# EAGLE design 04B-060 (EAGLE 9.6.2)
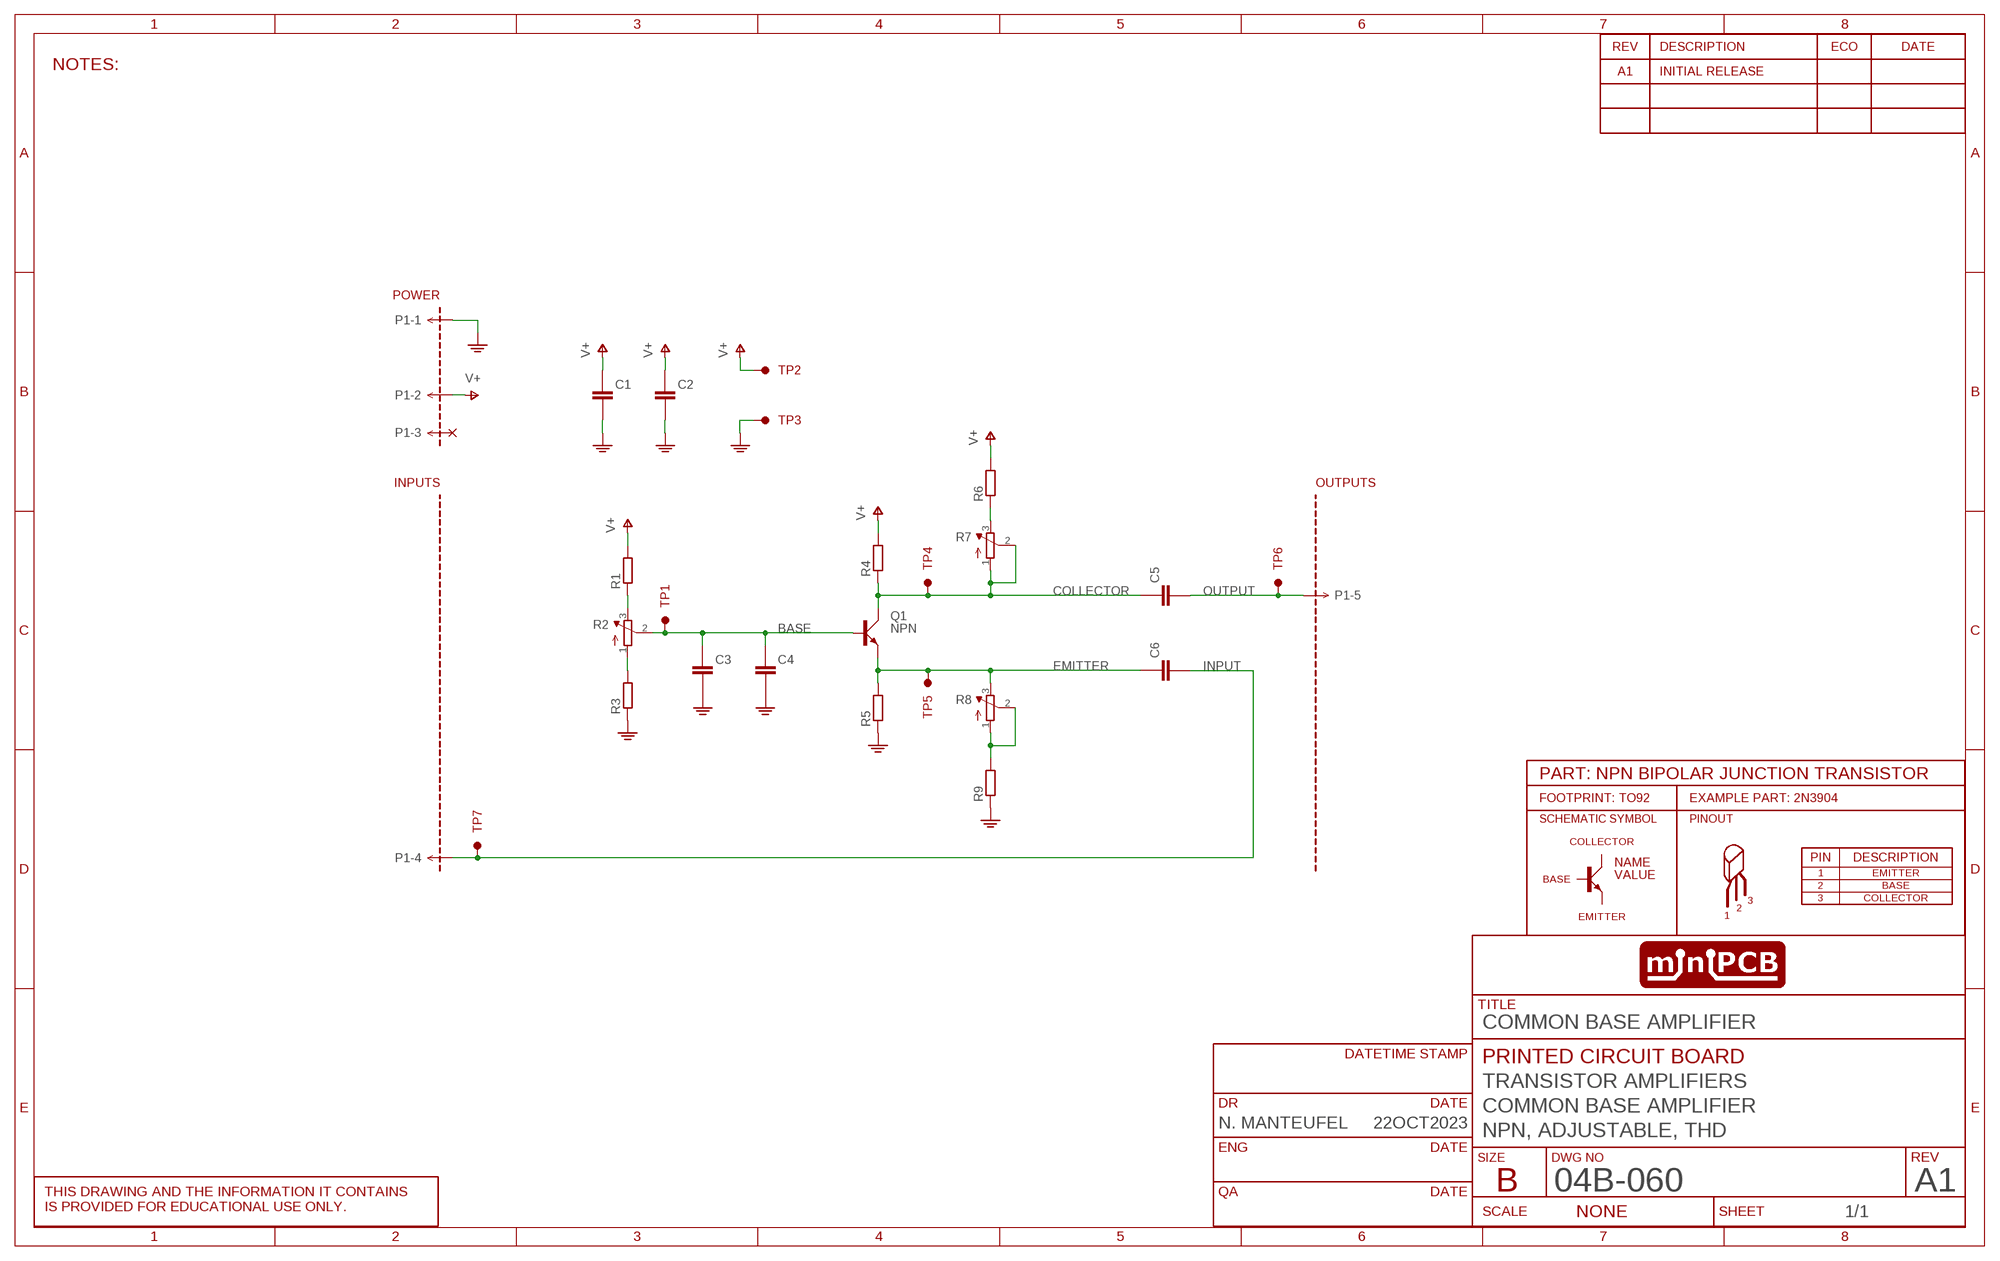
[diagram p0: schematic, sheet 1]
SHEET1 (SCHEMATIC): CIRCUIT_CATEGORY: TRANSISTOR AMPLIFIERS; CIRCUIT_NAME: COMMON BASE AMPLIFIER; CIRCUIT_VARIANT: NPN, ADJUSTABLE, THD; DR: N. MANTEUFEL; DR_DATE: 22OCT2023; PCB_PCBA: PRINTED CIRCUIT BOARD; REVA: A1; REVISION: A1; TITLE: COMMON BASE AMPLIFIER

## Parts
C1  CAPACITOR_10  [C5MM]
C2  CAPACITORTHD  [C050-024X044]
C3  CAPACITOR_10  [C5MM]
C4  CAPACITORTHD  [C050-024X044]
C5  CAPACITORTHD  [C050-024X044]
C6  CAPACITORTHD  [C050-024X044]
P1  MINIPCB_5P5P  [PINS_1X5]
PCB1  MINIPCB_0P50X50  [MINIPCB_0P_50X50MM]
Q1  NPN  BJT_NPNEBC  [TO92-EBC-OVAL]
R1  RESISTORTHD  [0204/10]
R2  TRIMPOT0.100THD  [TRIM_0100]
R3  RESISTORTHD  [0204/10]
R4  RESISTORTHD  [0204/10]
R5  RESISTORTHD  [0204/10]
R6  RESISTORTHD  [0204/10]
R7  TRIMPOT0.100THD  [TRIM_0100]
R8  TRIMPOT0.100THD  [TRIM_0100]
R9  RESISTORTHD  [0204/10]
TP1  TESTPOINTKE5000-SMTEXT  [PINS_1_TESTPOINT_KE5000_NOTEXT]
TP2  TESTPOINTKE5000-SMTEXT  [PINS_1_TESTPOINT_KE5000_NOTEXT]
TP3  TESTPOINTKE5000-SMTEXT  [PINS_1_TESTPOINT_KE5000_NOTEXT]
TP4  TESTPOINTKE5000-SMTEXT  [PINS_1_TESTPOINT_KE5000_NOTEXT]
TP5  TESTPOINTKE5000-SMTEXT  [PINS_1_TESTPOINT_KE5000_NOTEXT]
TP6  TESTPOINTKE5000-SMTEXT  [PINS_1_TESTPOINT_KE5000_NOTEXT]
TP7  TESTPOINTKE5000-SMTEXT  [PINS_1_TESTPOINT_KE5000_NOTEXT]

## Nets
BASE: C3.+ C4.1(+) Q1.B R2.2(S) TP1.1
COLLECTOR: C5.1(+) Q1.C R4.1 R7.1(A) R7.2(S) TP4.1
EMITTER: C6.1(+) Q1.E R5.2 R8.3(E) TP5.1
GND: C1.- C2.2(-) C3.- C4.2(-) P1.1 R3.1 R5.1 R9.1 TP3.1
INPUT: C6.2(-) P1.4 TP7.1
N$1: R2.1(A) R3.2
N$2: R1.1 R2.3(E)
N$3: R8.1(A) R8.2(S) R9.2
N$4: R6.1 R7.3(E)
OUTPUT: C5.2(-) P1.5 TP6.1
V+: C1.+ C2.1(+) P1.2 R1.2 R4.2 R6.2 TP2.1
Unconnected: P1.3

## Notes on the sheet
- NOTES:

## Library data of the parts
C1-C6 = minipcb:CAPACITOR
P1 = minipcb:MINIPCB_5P
PCB1 = minipcb:MINIPCB_0P; CIRCUIT_CATEGORY: TRANSISTOR AMPLIFIERS; PART_NUMBER: 04B-060; REVISION: A1-01; TITLE: COMMON BASE AMPLIFIER
Q1 = minipcb:BJT_NPN: TRANSISTOR
R1 R3-R6 R9 = minipcb:RESISTOR
R2 R7 R8 = minipcb:TRIMPOT: SMT trimmer potentiometer part number TC33X http://www.ladyada.net/library/eagle
TP1-TP7 = minipcb:TESTPOINT

## Board
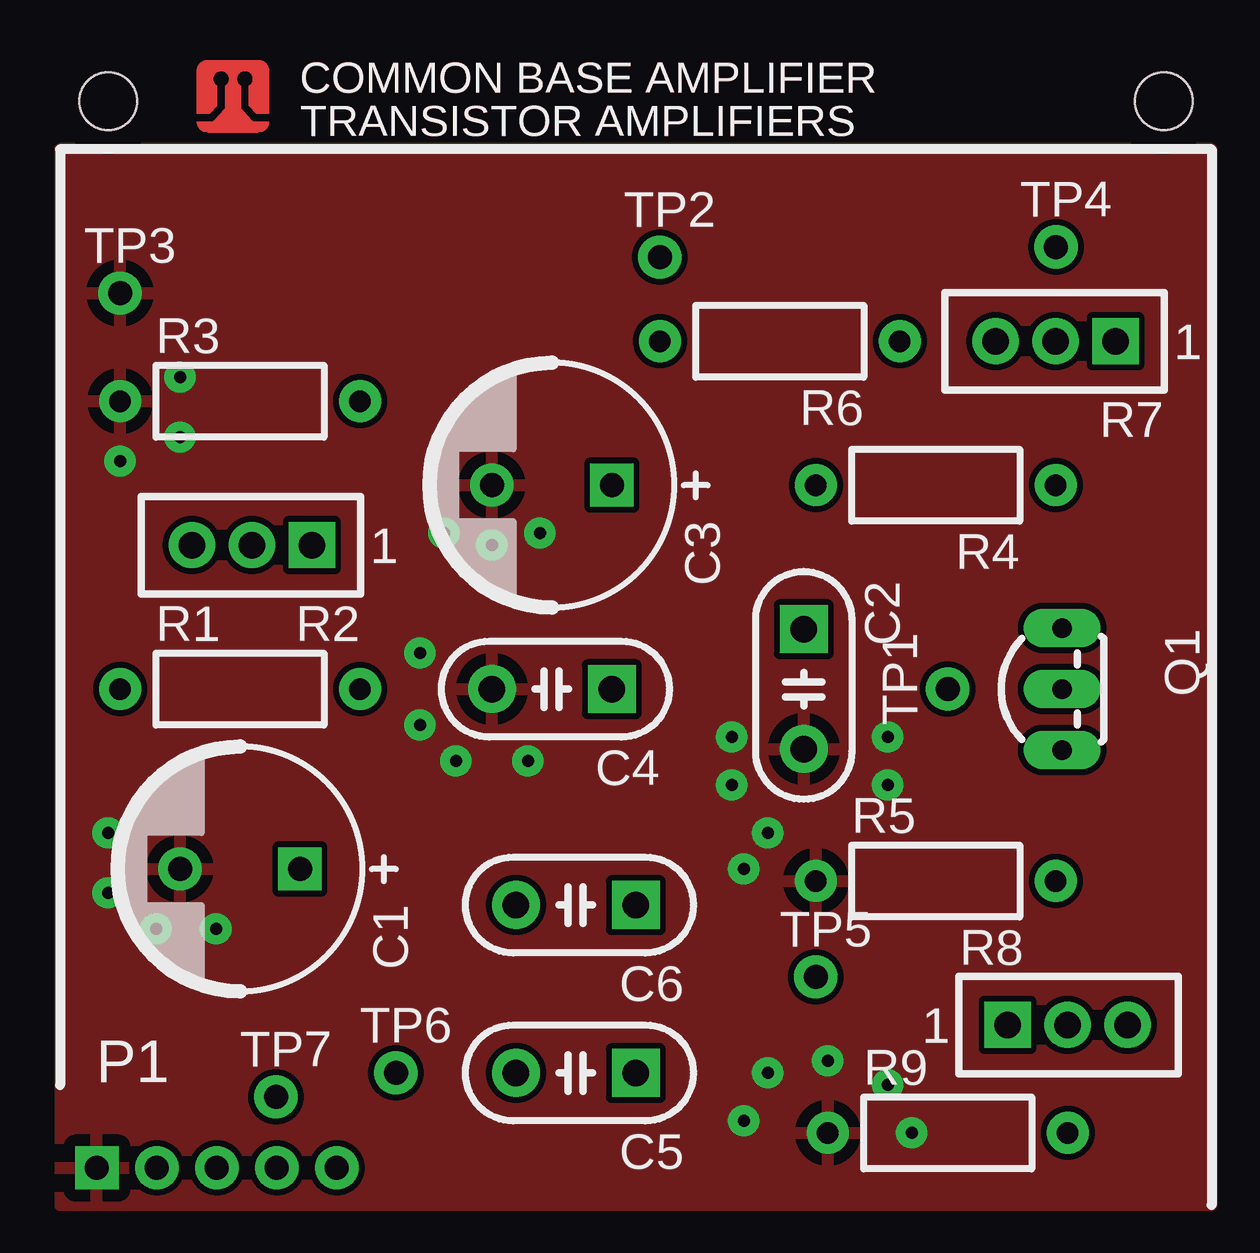
[diagram p1: board, top side]
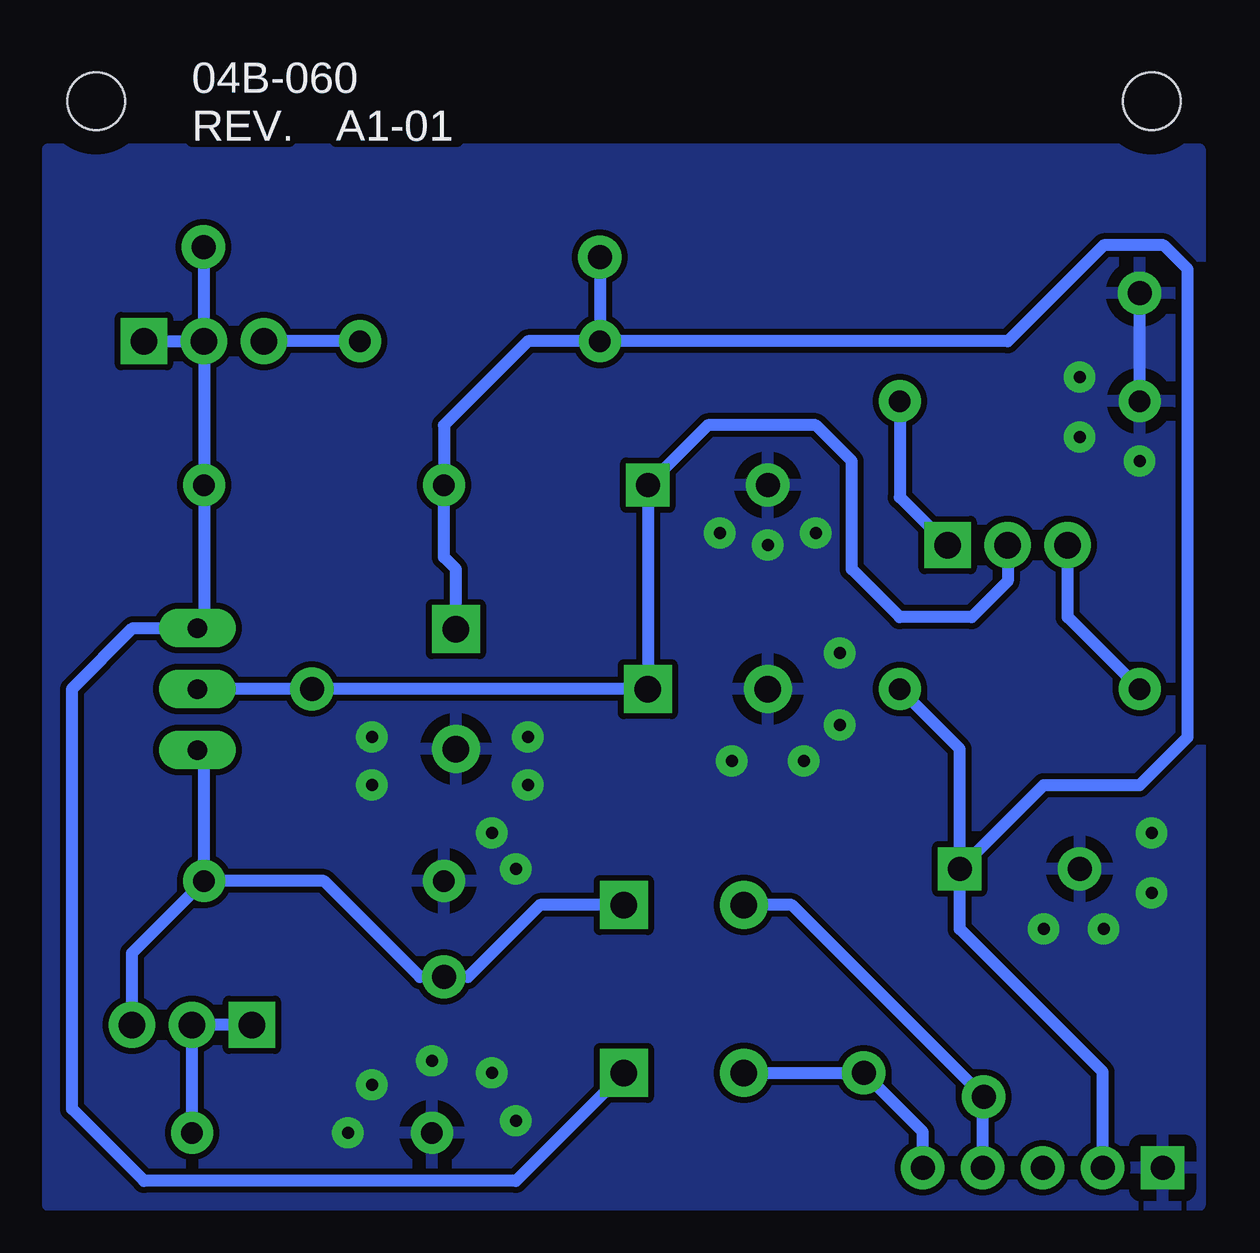
[diagram p2: board, bottom side, seen from below]

No outline drawn. Coordinates in mm, seen from the top.
Copper layers (1*16): Top 0.035mm / dielectric 1.5mm / Bottom 0.035mm
Design rules "minipcb": minimum track width 0.2mm, minimum drill 0.5mm, track to track 0.25mm, track to pad 0.5mm, pad to pad 0.5mm, via to via 0.5mm, smd to smd 0.15mm, copper to edge 1mm, drill to drill 1mm, minimum pad ring 0.4mm, minimum via ring 0.4mm, stop-mask expansion 0.1mm, vias tented up to drill 0.6mm, thermal gap 0.5mm

### Footprints (pad centres in the part's own frame; a part is rotated, then mirrored left to right if it is on the bottom)
C5MM = drill 1 square: + -2.5,0 | drill 1: - 2.5,0
C050-024X044 = drill 1.1 pad 2 square: 1 -2.5,0 | drill 1.1 pad 2: 2 2.5,0
PINS_1X5 = drill 1 square: 1 0,0 | drill 1: 2 2.5,0; 3 5,0; 4 7.5,0; 5 10,0
MINIPCB_0P_50X50MM = hole 2.4: 47,47; 3,47
TO92-EBC-OVAL = drill 0.813 long: B 0,-1.27; C 2.54,-1.27; E -2.54,-1.27
0204/10 = drill 0.9 pad 1.75: 1 -5,0; 2 5,0
TRIM_0100 = drill 1.1 pad 1.93 square: 1 0,0 | drill 1.1 pad 1.93: 2 2.5,0; 3 5,0
PINS_1_TESTPOINT_KE5000_NOTEXT = drill 1: 1 0,0

### Placement (x,y rotation side)
C1  8.5,15 180 top
C2  32,22.5 270 top
C3  21.5,31 180 top
C4  21.5,22.5 180 top
C5  22.5,6.5 180 top
C6  22.5,13.5 180 top
P1  2.54,2.54 0 top
PCB1  0,0 0 top
Q1  41.5,22.5 90 top
R1  8.5,22.5 0 top
R2  11.5,28.5 180 top
R3  8.5,34.5 0 top
R4  37.5,31 180 top
R5  37.5,14.5 0 top
R6  31,37 180 top
R7  45,37 180 top
R8  40.5,8.5 0 top
R9  38,4 0 top
TP1  38,22.5 90 top
TP2  26,40.5 0 top
TP3  3.5,39 0 top
TP4  42.52,40.93 0 top
TP5  32.5,10.5 0 top
TP6  15,6.5 0 top
TP7  10,5.5 0 top

### Tracks (layer width: path | path; a pad name or v marks a point on that pad's centre or on a via)
BASE
  Bottom 0.5: R2.2 9,27 10.5,25.5 13.5,25.5 15.5,27.5 15.5,32 17,33.5 21.5,33.5 C3.+ C4.1 TP1.1 Q1.B
COLLECTOR
  Bottom 0.5: R7.1 R7.2 | R7.2 R4.1 42.5,25.31 Q1.C 45.46,25.04 48,22.5 48,5 45,2 29.5,2 C5.1 | TP4.1 42.52,37.02 R7.2
EMITTER
  Bottom 0.5: R5.2 42.5,19.69 Q1.E | R8.3 45.5,11.5 R5.2 | C6.1 28.5,13.5 31.5,10.5 TP5.1 33.5,10.5 37.5,14.5 R5.2
GND  (via drill 0.5)
  Bottom 0.5: R3.1 TP3.1
  other vias: 16,24 16,21 17.5,19.5 20.5,19.5 29,20.5 29,18.5 29.5,15 29.5,4.5 30.5,6.5 33,7 36.5,4 35.5,6 21,29 19,28.5 17,29 7.5,12.5 5,12.5 3,14 3,16.5 3.5,32 6,33 6,35.5 35.5,20.5 35.5,18.5 30.5,16.5
  pour Bottom: 1,1 49,1 49,45 1,45
  pour Top: 1,1 49,1 49,45 1,45
INPUT
  Bottom 0.5: P1.4 10.04,5.46 TP7.1 18,13.5 C6.2
N$1
  Bottom 0.5: R3.2 13.5,30.5 R2.1
N$2
  Bottom 0.5: R1.1 6.5,25.5 R2.3
N$3
  Bottom 0.5: R8.1 R8.2 R9.2
N$4
  Bottom 0.5: R6.1 R7.3
OUTPUT
  Bottom 0.5: P1.5 12.54,4.04 TP6.1 C5.2
V+
  Bottom 0.5: P1.2 5.04,6.54 11,12.5 C1.+ | C1.+ 11,20 R1.2 | C1.+ 7.5,18.5 3.5,18.5 1.5,20.5 1.5,40 2.5,41 5,41 9,37 R6.2 | R6.2 29,37 32.5,33.5 R4.2 32.5,28 32,27.5 C2.1 | TP2.1 R6.2